# Altium schematic sheet PX4FMUv2.4.6_9.SchDoc
size 282 x 200 mm
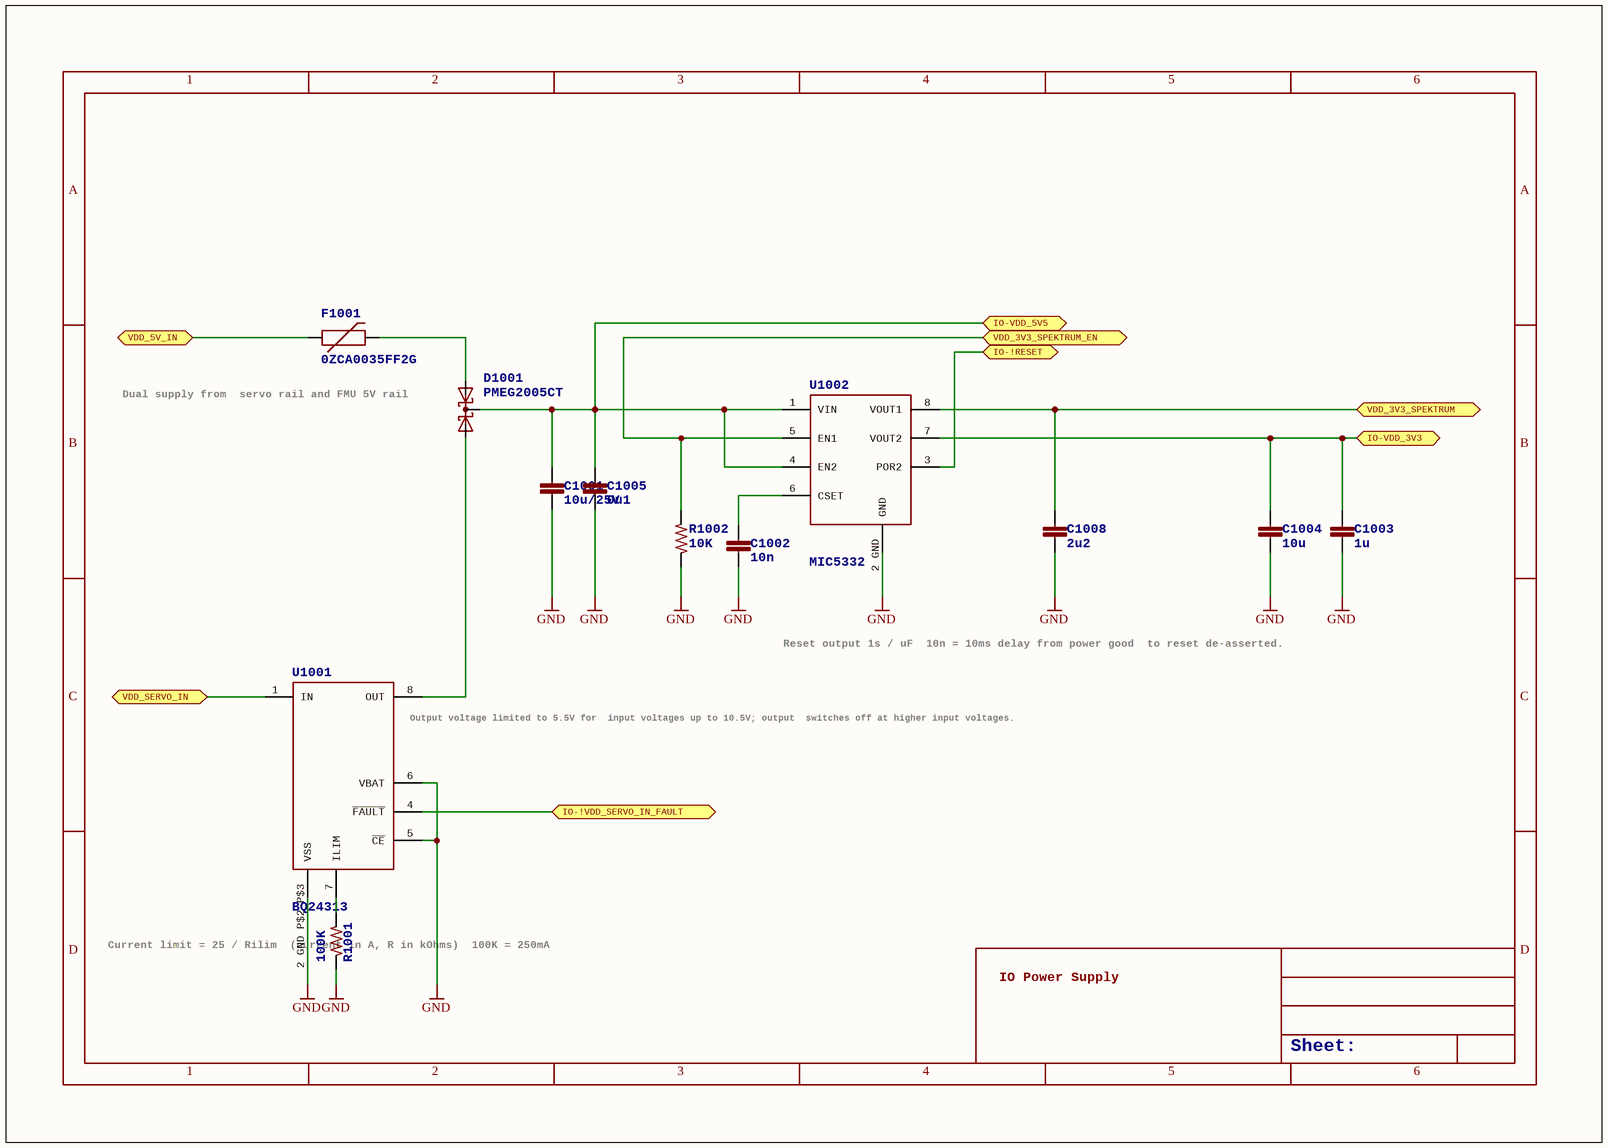
[diagram p0: PX4FMUv2.4.6_9.SchDoc]

## Parts
C1001  10u/25V  [0805-CAP]
C1002  10n  [0402-CAP]
C1003  1u  [0603-CAP]
C1004  10u  [0603-CAP]
C1005  0u1  [0402-CAP]
C1008  2u2  [0402-CAP]
D1001  PMEG2005CT  [SOT23-3]
F1001  0ZCA0035FF2G  [PTC-1206]
R1001  100K  [0402-RES]
R1002  10K  [0402-RES]
U1001  BQ24313  [QFN8-DSG]
U1002  MIC5332  [MLF-8-EPAD]

## Ports
IO-!RESET, IO-!VDD_SERVO_IN_FAULT, IO-VDD_3V3, IO-VDD_5V5, VDD_3V3_SPEKTRUM, VDD_3V3_SPEKTRUM_EN, VDD_5V_IN, VDD_SERVO_IN

## Nets
GND: C1001.P$2 C1002.P$2 C1003.P$2 C1004.P$2 C1005.P$2 C1008.P$2 R1001.P$1 R1002.P$1 U1001.2_GND_P$2_P$3(VSS) U1001.5(~{CE}) U1001.6(VBAT) U1002.2_GND(GND)
IO-!RESET: U1002.3(POR2) ; port IO-!RESET
IO-!VDD_SERVO_IN_FAULT: U1001.4(~{FAULT}) ; port IO-!VDD_SERVO_IN_FAULT
IO-VDD_3V3: C1003.P$1 C1004.P$1 U1002.7(VOUT2) ; port IO-VDD_3V3
IO-VDD_5V5: C1001.P$1 C1005.P$1 D1001.3(CC) U1002.1(VIN) U1002.4(EN2) ; port IO-VDD_5V5
VDD_3V3_SPEKTRUM: C1008.P$1 U1002.8(VOUT1) ; port VDD_3V3_SPEKTRUM
VDD_3V3_SPEKTRUM_EN: R1002.P$2 U1002.5(EN1) ; port VDD_3V3_SPEKTRUM_EN
VDD_5V_IN: F1001.1 ; port VDD_5V_IN
VDD_SERVO_IN: U1001.1(IN) ; port VDD_SERVO_IN
NetC1002_P$1: C1002.P$1 U1002.6(CSET)
NetD1001_1: D1001.1(A1) F1001.2
NetD1001_2: D1001.2(A2) U1001.8(OUT)
NetR1001_P$2: R1001.P$2 U1001.7(ILIM)

## Notes on the sheet
- (near F1001) Dual supply from
  servo rail and FMU 5V rail
- Reset output 1s / uF
  10n = 10ms delay from power good
  to reset de-asserted.
- (near U1001) Output voltage limited to 5.5V for
  input voltages up to 10.5V; output
  switches off at higher input voltages.
- (near R1001) Current limit = 25 / Rilim
  (current in A, R in kOhms)
  100K = 250mA
- IO Power Supply
- Sheet:
- 1
- 2
- 3
- 4
- 5
- 6
- A
- B
- C
- D

## Library data of the parts
C1001 = CAP0805: CapacitorStandard 0603 ceramic capacitor, and 0.1" leaded capacitor.; PARTNO: CL21A106KAYNNNE
C1002 = CAP0402: CapacitorStandard 0603 ceramic capacitor, and 0.1" leaded capacitor.; PARTNO: CC0402KRX7R7BB103
C1003 = CAP0603: CapacitorStandard 0603 ceramic capacitor, and 0.1" leaded capacitor.; PARTNO: CC0603ZRY5V7BB105
C1004 = CAP0603: CapacitorStandard 0603 ceramic capacitor, and 0.1" leaded capacitor.; PARTNO: C1608X5R1A106K080AC
C1005 = CAP0402: CapacitorStandard 0603 ceramic capacitor, and 0.1" leaded capacitor.; PARTNO: CC0402ZRY5V7BB104
C1008 = CAP0402: CapacitorStandard 0603 ceramic capacitor, and 0.1" leaded capacitor.; PARTNO: C1005X6S1C225K050BC
D1001 = PMEG2005CT: 500 mA low VF dual MEGA Schottky barrier rectifier   http://www.nxp.com/documents/data_sheet/PMEG2005CT.pdf; PARTNO: PMEG2005CT
F1001 = PTCSMD: Resettable Fuse PTCResettable Fuse. Spark Fun Electronics SKU : COM-08357; PARTNO: 0ZCA0035FF2G
R1001 = RESISTOR0402-RES: ResistorBasic schematic elements and footprints for 0603, 1206, and PTH 1/10th watt (small) resistors.
R1002 = RESISTOR0402-RES: ResistorBasic schematic elements and footprints for 0603, 1206, and PTH 1/10th watt (small) resistors.; PARTNO: RC0402FR-0710KL
U1001 = BQ24313: PARTNO: BQ24313DSGT
U1002 = MIC5332: PARTNO: MIC5332-SSYMT